# Altium schematic sheet Modems.SchDoc
size A2
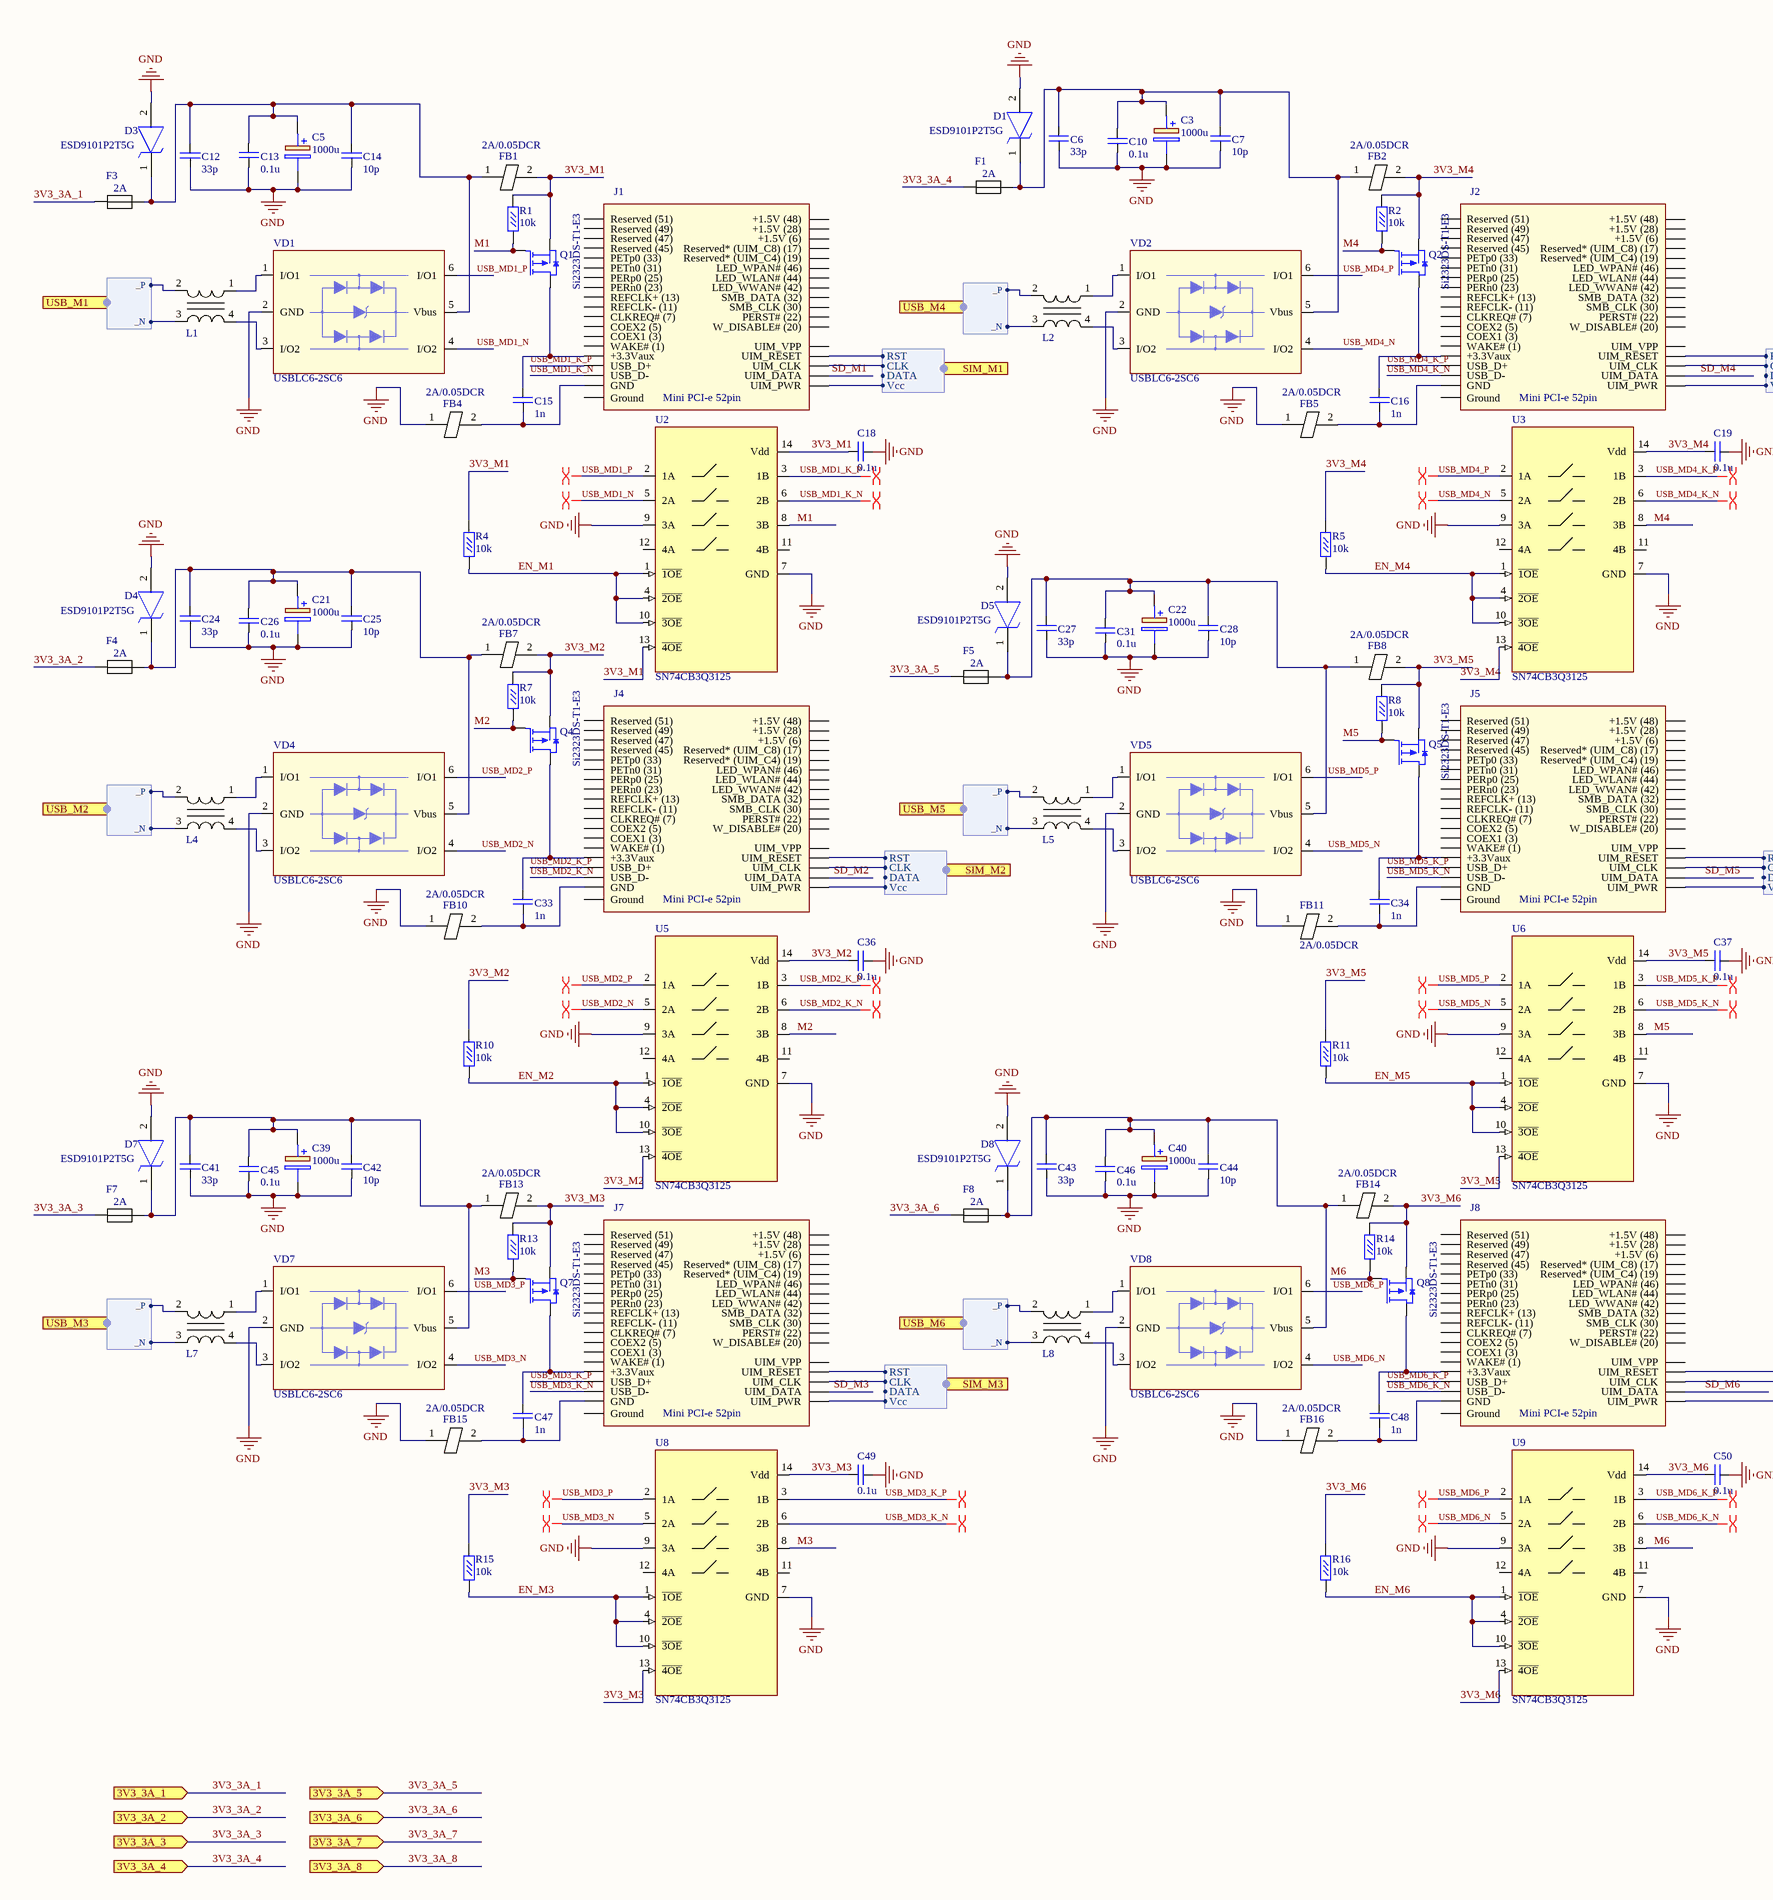
[diagram p0: Modems.SchDoc, left]
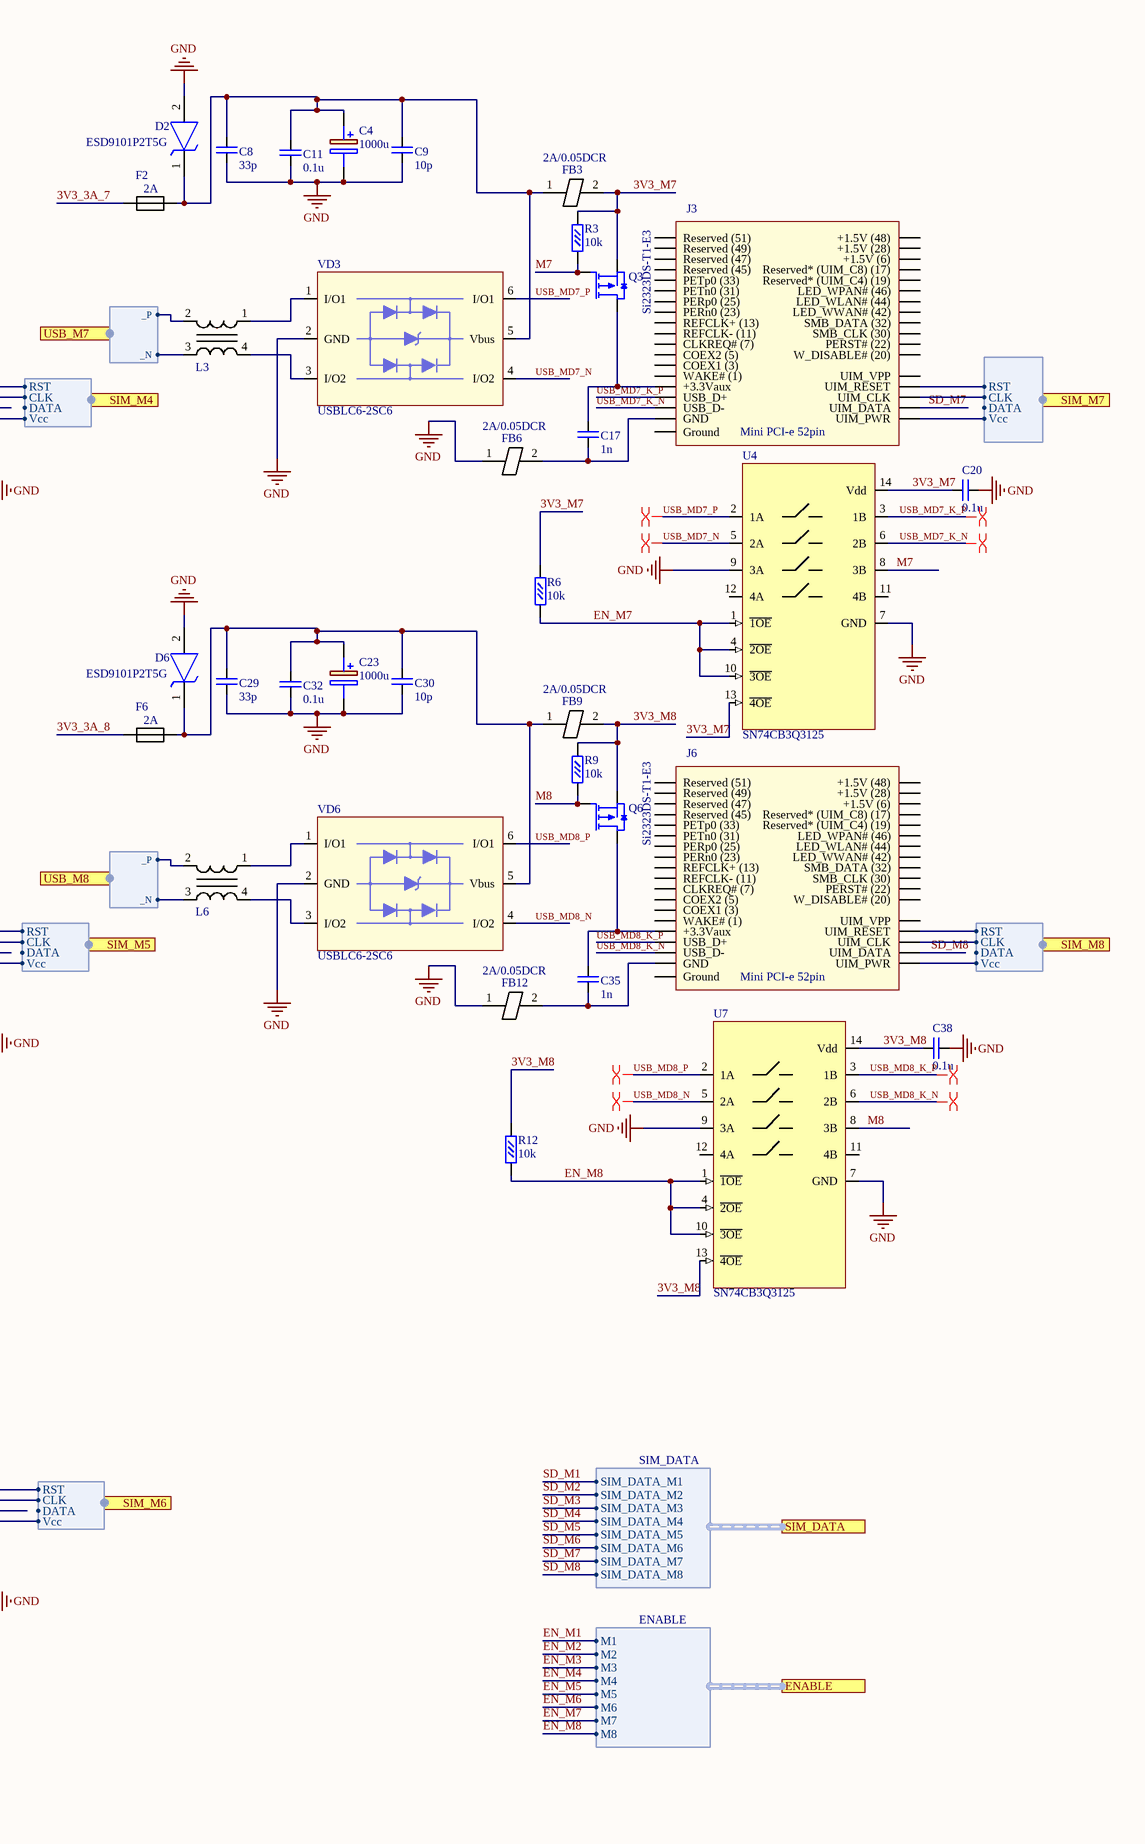
[diagram p1: Modems.SchDoc, right]

## Parts
C3  value 1000u  [CAPAE1030X1030N]  (hidden comment: Конденсатор электролитический алюминиевый, 1000мкФ, 6В, 1010)
C4  value 1000u  [CAPAE1030X1030N]  (hidden comment: Конденсатор электролитический алюминиевый, 1000мкФ, 6В, 1010)
C5  value 1000u  [CAPAE1030X1030N]  (hidden comment: Конденсатор электролитический алюминиевый, 1000мкФ, 6В, 1010)
C6  value 33p  [C0402]  (hidden comment: Конденсатор SMD, 33пФ, X7R, 16В, 10%, 0402)
C7  value 10p  [C0402]  (hidden comment: Конденсатор SMD, 10пФ, X7R, 16В, 10%, 0402)
C8  value 33p  [C0402]  (hidden comment: Конденсатор SMD, 33пФ, X7R, 16В, 10%, 0402)
C9  value 10p  [C0402]  (hidden comment: Конденсатор SMD, 10пФ, X7R, 16В, 10%, 0402)
C10  value 0.1u  [C0402]  (hidden comment: Конденсатор SMD, 0.1мкФ, X7R, 25В, 10%, 0402)
C11  value 0.1u  [C0402]  (hidden comment: Конденсатор SMD, 0.1мкФ, X7R, 25В, 10%, 0402)
C12  value 33p  [C0402]  (hidden comment: Конденсатор SMD, 33пФ, X7R, 16В, 10%, 0402)
C13  value 0.1u  [C0402]  (hidden comment: Конденсатор SMD, 0.1мкФ, X7R, 25В, 10%, 0402)
C14  value 10p  [C0402]  (hidden comment: Конденсатор SMD, 10пФ, X7R, 16В, 10%, 0402)
C15  value 1n  [C0402]  (hidden comment: Конденсатор SMD, 1нФ, X7R, 25В, 10%, 0402)
C16  value 1n  [C0402]  (hidden comment: Конденсатор SMD, 1нФ, X7R, 25В, 10%, 0402)
C17  value 1n  [C0402]  (hidden comment: Конденсатор SMD, 1нФ, X7R, 25В, 10%, 0402)
C18  value 0.1u  [C0402]  (hidden comment: Конденсатор SMD, 0.1мкФ, X7R, 25В, 10%, 0402)
C19  value 0.1u  [C0402]  (hidden comment: Конденсатор SMD, 0.1мкФ, X7R, 25В, 10%, 0402)
C20  value 0.1u  [C0402]  (hidden comment: Конденсатор SMD, 0.1мкФ, X7R, 25В, 10%, 0402)
C21  value 1000u  [CAPAE1030X1030N]  (hidden comment: Конденсатор электролитический алюминиевый, 1000мкФ, 6В, 1010)
C22  value 1000u  [CAPAE1030X1030N]  (hidden comment: Конденсатор электролитический алюминиевый, 1000мкФ, 6В, 1010)
C23  value 1000u  [CAPAE1030X1030N]  (hidden comment: Конденсатор электролитический алюминиевый, 1000мкФ, 6В, 1010)
C24  value 33p  [C0402]  (hidden comment: Конденсатор SMD, 33пФ, X7R, 16В, 10%, 0402)
C25  value 10p  [C0402]  (hidden comment: Конденсатор SMD, 10пФ, X7R, 16В, 10%, 0402)
C26  value 0.1u  [C0402]  (hidden comment: Конденсатор SMD, 0.1мкФ, X7R, 25В, 10%, 0402)
C27  value 33p  [C0402]  (hidden comment: Конденсатор SMD, 33пФ, X7R, 16В, 10%, 0402)
C28  value 10p  [C0402]  (hidden comment: Конденсатор SMD, 10пФ, X7R, 16В, 10%, 0402)
C29  value 33p  [C0402]  (hidden comment: Конденсатор SMD, 33пФ, X7R, 16В, 10%, 0402)
C30  value 10p  [C0402]  (hidden comment: Конденсатор SMD, 10пФ, X7R, 16В, 10%, 0402)
C31  value 0.1u  [C0402]  (hidden comment: Конденсатор SMD, 0.1мкФ, X7R, 25В, 10%, 0402)
C32  value 0.1u  [C0402]  (hidden comment: Конденсатор SMD, 0.1мкФ, X7R, 25В, 10%, 0402)
C33  value 1n  [C0402]  (hidden comment: Конденсатор SMD, 1нФ, X7R, 25В, 10%, 0402)
C34  value 1n  [C0402]  (hidden comment: Конденсатор SMD, 1нФ, X7R, 25В, 10%, 0402)
C35  value 1n  [C0402]  (hidden comment: Конденсатор SMD, 1нФ, X7R, 25В, 10%, 0402)
C36  value 0.1u  [C0402]  (hidden comment: Конденсатор SMD, 0.1мкФ, X7R, 25В, 10%, 0402)
C37  value 0.1u  [C0402]  (hidden comment: Конденсатор SMD, 0.1мкФ, X7R, 25В, 10%, 0402)
C38  value 0.1u  [C0402]  (hidden comment: Конденсатор SMD, 0.1мкФ, X7R, 25В, 10%, 0402)
C39  value 1000u  [CAPAE1030X1030N]  (hidden comment: Конденсатор электролитический алюминиевый, 1000мкФ, 6В, 1010)
C40  value 1000u  [CAPAE1030X1030N]  (hidden comment: Конденсатор электролитический алюминиевый, 1000мкФ, 6В, 1010)
C41  value 33p  [C0402]  (hidden comment: Конденсатор SMD, 33пФ, X7R, 16В, 10%, 0402)
C42  value 10p  [C0402]  (hidden comment: Конденсатор SMD, 10пФ, X7R, 16В, 10%, 0402)
C43  value 33p  [C0402]  (hidden comment: Конденсатор SMD, 33пФ, X7R, 16В, 10%, 0402)
C44  value 10p  [C0402]  (hidden comment: Конденсатор SMD, 10пФ, X7R, 16В, 10%, 0402)
C45  value 0.1u  [C0402]  (hidden comment: Конденсатор SMD, 0.1мкФ, X7R, 25В, 10%, 0402)
C46  value 0.1u  [C0402]  (hidden comment: Конденсатор SMD, 0.1мкФ, X7R, 25В, 10%, 0402)
C47  value 1n  [C0402]  (hidden comment: Конденсатор SMD, 1нФ, X7R, 25В, 10%, 0402)
C48  value 1n  [C0402]  (hidden comment: Конденсатор SMD, 1нФ, X7R, 25В, 10%, 0402)
C49  value 0.1u  [C0402]  (hidden comment: Конденсатор SMD, 0.1мкФ, X7R, 25В, 10%, 0402)
C50  value 0.1u  [C0402]  (hidden comment: Конденсатор SMD, 0.1мкФ, X7R, 25В, 10%, 0402)
D1  ESD9101P2T5G  [SODFL1006X40N]
D2  ESD9101P2T5G  [SODFL1006X40N]
D3  ESD9101P2T5G  [SODFL1006X40N]
D4  ESD9101P2T5G  [SODFL1006X40N]
D5  ESD9101P2T5G  [SODFL1006X40N]
D6  ESD9101P2T5G  [SODFL1006X40N]
D7  ESD9101P2T5G  [SODFL1006X40N]
D8  ESD9101P2T5G  [SODFL1006X40N]
F1  Fuse MF-MSMF 2A  [MF-MSMF Fuse]  (value not drawn)
F2  Fuse MF-MSMF 2A  [MF-MSMF Fuse]  (value not drawn)
F3  Fuse MF-MSMF 2A  [MF-MSMF Fuse]  (value not drawn)
F4  Fuse MF-MSMF 2A  [MF-MSMF Fuse]  (value not drawn)
F5  Fuse MF-MSMF 2A  [MF-MSMF Fuse]  (value not drawn)
F6  Fuse MF-MSMF 2A  [MF-MSMF Fuse]  (value not drawn)
F7  Fuse MF-MSMF 2A  [MF-MSMF Fuse]  (value not drawn)
F8  Fuse MF-MSMF 2A  [MF-MSMF Fuse]  (value not drawn)
FB1  2A/0.05DCR  [RESC2012X70N]
FB2  2A/0.05DCR  [RESC2012X70N]
FB3  2A/0.05DCR  [RESC2012X70N]
FB4  2A/0.05DCR  [RESC2012X70N]
FB5  2A/0.05DCR  [RESC2012X70N]
FB6  2A/0.05DCR  [RESC2012X70N]
FB7  2A/0.05DCR  [RESC2012X70N]
FB8  2A/0.05DCR  [RESC2012X70N]
FB9  2A/0.05DCR  [RESC2012X70N]
FB10  2A/0.05DCR  [RESC2012X70N]
FB11  2A/0.05DCR  [RESC2012X70N]
FB12  2A/0.05DCR  [RESC2012X70N]
FB13  2A/0.05DCR  [RESC2012X70N]
FB14  2A/0.05DCR  [RESC2012X70N]
FB15  2A/0.05DCR  [RESC2012X70N]
FB16  2A/0.05DCR  [RESC2012X70N]
J1  Mini PCI-e 52pin  [Mini PCI-E 52pin 2 mnt]
J2  Mini PCI-e 52pin  [Mini PCI-E 52pin 2 mnt]
J3  Mini PCI-e 52pin  [Mini PCI-E 52pin 2 mnt]
J4  Mini PCI-e 52pin  [Mini PCI-E 52pin 2 mnt]
J5  Mini PCI-e 52pin  [Mini PCI-E 52pin 2 mnt]
J6  Mini PCI-e 52pin  [Mini PCI-E 52pin 2 mnt]
J7  Mini PCI-e 52pin  [Mini PCI-E 52pin 2 mnt]
J8  Mini PCI-e 52pin  [Mini PCI-E 52pin 2 mnt]
L1  Inductor ESD (Choke)  [EMI Choke Murata]  (value not drawn)
L2  Inductor ESD (Choke)  [EMI Choke Murata]  (value not drawn)
L3  Inductor ESD (Choke)  [EMI Choke Murata]  (value not drawn)
L4  Inductor ESD (Choke)  [EMI Choke Murata]  (value not drawn)
L5  Inductor ESD (Choke)  [EMI Choke Murata]  (value not drawn)
L6  Inductor ESD (Choke)  [EMI Choke Murata]  (value not drawn)
L7  Inductor ESD (Choke)  [EMI Choke Murata]  (value not drawn)
L8  Inductor ESD (Choke)  [EMI Choke Murata]  (value not drawn)
Q1  Транзистор, Si2323DS-T1-E3  [SOT23]  (value not drawn)
Q2  Транзистор, Si2323DS-T1-E3  [SOT23]  (value not drawn)
Q3  Транзистор, Si2323DS-T1-E3  [SOT23]  (value not drawn)
Q4  Транзистор, Si2323DS-T1-E3  [SOT23]  (value not drawn)
Q5  Транзистор, Si2323DS-T1-E3  [SOT23]  (value not drawn)
Q6  Транзистор, Si2323DS-T1-E3  [SOT23]  (value not drawn)
Q7  Транзистор, Si2323DS-T1-E3  [SOT23]  (value not drawn)
Q8  Транзистор, Si2323DS-T1-E3  [SOT23]  (value not drawn)
R1  value 10k  [R0603]  (hidden comment: Резистор SMD, 0.1Вт, 0603, 10кОм, 1%)
R2  value 10k  [R0603]  (hidden comment: Резистор SMD, 0.1Вт, 0603, 10кОм, 1%)
R3  value 10k  [R0603]  (hidden comment: Резистор SMD, 0.1Вт, 0603, 10кОм, 1%)
R4  value 10k  [R0603]  (hidden comment: Резистор SMD, 0.1Вт, 0603, 10кОм, 1%)
R5  value 10k  [R0603]  (hidden comment: Резистор SMD, 0.1Вт, 0603, 10кОм, 1%)
R6  value 10k  [R0603]  (hidden comment: Резистор SMD, 0.1Вт, 0603, 10кОм, 1%)
R7  value 10k  [R0603]  (hidden comment: Резистор SMD, 0.1Вт, 0603, 10кОм, 1%)
R8  value 10k  [R0603]  (hidden comment: Резистор SMD, 0.1Вт, 0603, 10кОм, 1%)
R9  value 10k  [R0603]  (hidden comment: Резистор SMD, 0.1Вт, 0603, 10кОм, 1%)
R10  value 10k  [R0603]  (hidden comment: Резистор SMD, 0.1Вт, 0603, 10кОм, 1%)
R11  value 10k  [R0603]  (hidden comment: Резистор SMD, 0.1Вт, 0603, 10кОм, 1%)
R12  value 10k  [R0603]  (hidden comment: Резистор SMD, 0.1Вт, 0603, 10кОм, 1%)
R13  value 10k  [R0603]  (hidden comment: Резистор SMD, 0.1Вт, 0603, 10кОм, 1%)
R14  value 10k  [R0603]  (hidden comment: Резистор SMD, 0.1Вт, 0603, 10кОм, 1%)
R15  value 10k  [R0603]  (hidden comment: Резистор SMD, 0.1Вт, 0603, 10кОм, 1%)
R16  value 10k  [R0603]  (hidden comment: Резистор SMD, 0.1Вт, 0603, 10кОм, 1%)
U2  Микросхема, SN74CB3Q3125  [14-TSOP]  (value not drawn)
U3  Микросхема, SN74CB3Q3125  [14-TSOP]  (value not drawn)
U4  Микросхема, SN74CB3Q3125  [14-TSOP]  (value not drawn)
U5  Микросхема, SN74CB3Q3125  [14-TSOP]  (value not drawn)
U6  Микросхема, SN74CB3Q3125  [14-TSOP]  (value not drawn)
U7  Микросхема, SN74CB3Q3125  [14-TSOP]  (value not drawn)
U8  Микросхема, SN74CB3Q3125  [14-TSOP]  (value not drawn)
U9  Микросхема, SN74CB3Q3125  [14-TSOP]  (value not drawn)
VD1  TVS Diode  [SOT23-6L]  (value not drawn)
VD2  TVS Diode  [SOT23-6L]  (value not drawn)
VD3  TVS Diode  [SOT23-6L]  (value not drawn)
VD4  TVS Diode  [SOT23-6L]  (value not drawn)
VD5  TVS Diode  [SOT23-6L]  (value not drawn)
VD6  TVS Diode  [SOT23-6L]  (value not drawn)
VD7  TVS Diode  [SOT23-6L]  (value not drawn)
VD8  TVS Diode  [SOT23-6L]  (value not drawn)

## Ports
3V3_3A_1 (in), 3V3_3A_2 (in), 3V3_3A_3 (in), 3V3_3A_4 (in), 3V3_3A_5 (in), 3V3_3A_6 (in), 3V3_3A_7 (in), 3V3_3A_8 (in), ENABLE (harness ENABLE), SIM_DATA (harness SIM_DATA), SIM_M1 (harness SIM), SIM_M2 (harness SIM), SIM_M3 (harness SIM), SIM_M4 (harness SIM), SIM_M5 (harness SIM), SIM_M6 (harness SIM), SIM_M7 (harness SIM), SIM_M8 (harness SIM), USB_M1 (harness DIFF), USB_M2 (harness DIFF), USB_M3 (harness DIFF), USB_M4 (harness DIFF), USB_M5 (harness DIFF), USB_M6 (harness DIFF), USB_M7 (harness DIFF), USB_M8 (harness DIFF)

## Harnesses
SIM: Vcc, RST, CLK, DATA
DIFF: _P, _N
SIM_DATA: SIM_DATA_M1, SIM_DATA_M2, SIM_DATA_M3, SIM_DATA_M4, SIM_DATA_M5, SIM_DATA_M6, SIM_DATA_M7, SIM_DATA_M8
ENABLE: M1, M2, M3, M4, M5, M6, M7, M8

## Nets
GND: C3.2(-) C4.2(-) C5.2(-) C6.1 C7.1 C8.1 C9.1 C10.2 C11.2 C12.1 C13.2 C14.1 C18.2 C19.2 C20.2 C21.2(-) C22.2(-) C23.2(-) C24.1 C25.1 C26.2 C27.1 C28.1 C29.1 C30.1 C31.2 C32.2 C36.2 C37.2 C38.2 C39.2(-) C40.2(-) C41.1 C42.1 C43.1 C44.1 C45.2 C46.2 C49.2 C50.2 D1.2(A) D2.2(A) D3.2(A) D4.2(A) D5.2(A) D6.2(A) D7.2(A) D8.2(A) FB4.1 FB5.1 FB6.1 FB10.1 FB11.1 FB12.1 FB15.1 FB16.1 U2.7(GND) U2.9(3A) U3.7(GND) U3.9(3A) U4.7(GND) U4.9(3A) U5.7(GND) U5.9(3A) U6.7(GND) U6.9(3A) U7.7(GND) U7.9(3A) U8.7(GND) U8.9(3A) U9.7(GND) U9.9(3A) VD1.2(GND) VD2.2(GND) VD3.2(GND) VD4.2(GND) VD5.2(GND) VD6.2(GND) VD7.2(GND) VD8.2(GND)
3V3_3A_1: F3.1 ; port 3V3_3A_1
3V3_3A_2: F4.1 ; port 3V3_3A_2
3V3_3A_3: F7.1 ; port 3V3_3A_3
3V3_3A_4: F1.1 ; port 3V3_3A_4
3V3_3A_5: F5.1 ; port 3V3_3A_5
3V3_3A_6: F8.1 ; port 3V3_3A_6
3V3_3A_7: F2.1 ; port 3V3_3A_7
3V3_3A_8: F6.1 ; port 3V3_3A_8
3V3_M1: C18.1 FB1.2 Q1.2(S) R1.2 R4.2 U2.13(~{4OE}) U2.14(Vdd)
3V3_M2: C36.1 FB7.2 Q4.2(S) R7.2 R10.2 U5.13(~{4OE}) U5.14(Vdd)
3V3_M3: C49.1 FB13.2 Q7.2(S) R13.2 R15.2 U8.13(~{4OE}) U8.14(Vdd)
3V3_M4: C19.1 FB2.2 Q2.2(S) R2.2 R5.2 U3.13(~{4OE}) U3.14(Vdd)
3V3_M5: C37.1 FB8.2 Q5.2(S) R8.2 R11.2 U6.13(~{4OE}) U6.14(Vdd)
3V3_M6: C50.1 FB14.2 Q8.2(S) R14.2 R16.2 U9.13(~{4OE}) U9.14(Vdd)
3V3_M7: C20.1 FB3.2 Q3.2(S) R3.2 R6.2 U4.13(~{4OE}) U4.14(Vdd)
3V3_M8: C38.1 FB9.2 Q6.2(S) R9.2 R12.2 U7.13(~{4OE}) U7.14(Vdd)
EN_M1: R4.1 U2.1(~{1OE}) U2.4(~{2OE}) U2.10(~{3OE}) ; port ENABLE.M1
EN_M2: R10.1 U5.1(~{1OE}) U5.4(~{2OE}) U5.10(~{3OE}) ; port ENABLE.M2
EN_M3: R15.1 U8.1(~{1OE}) U8.4(~{2OE}) U8.10(~{3OE}) ; port ENABLE.M3
EN_M4: R5.1 U3.1(~{1OE}) U3.4(~{2OE}) U3.10(~{3OE}) ; port ENABLE.M4
EN_M5: R11.1 U6.1(~{1OE}) U6.4(~{2OE}) U6.10(~{3OE}) ; port ENABLE.M5
EN_M6: R16.1 U9.1(~{1OE}) U9.4(~{2OE}) U9.10(~{3OE}) ; port ENABLE.M6
EN_M7: R6.1 U4.1(~{1OE}) U4.4(~{2OE}) U4.10(~{3OE}) ; port ENABLE.M7
EN_M8: R12.1 U7.1(~{1OE}) U7.4(~{2OE}) U7.10(~{3OE}) ; port ENABLE.M8
M1: Q1.1(G) R1.1 U2.8(3B)
M2: Q4.1(G) R7.1 U5.8(3B)
M3: Q7.1(G) R13.1 U8.8(3B)
M4: Q2.1(G) R2.1 U3.8(3B)
M5: Q5.1(G) R8.1 U6.8(3B)
M6: Q8.1(G) R14.1 U9.8(3B)
M7: Q3.1(G) R3.1 U4.8(3B)
M8: Q6.1(G) R9.1 U7.8(3B)
SD_M1: J1.10(UIM_DATA) ; port SIM_DATA.SIM_DATA_M1
SD_M2: J4.10(UIM_DATA) ; port SIM_DATA.SIM_DATA_M2
SD_M3: J7.10(UIM_DATA) ; port SIM_DATA.SIM_DATA_M3
SD_M4: J2.10(UIM_DATA) ; port SIM_DATA.SIM_DATA_M4
SD_M5: J5.10(UIM_DATA) ; port SIM_DATA.SIM_DATA_M5
SD_M6: J8.10(UIM_DATA) ; port SIM_DATA.SIM_DATA_M6
SD_M7: J3.10(UIM_DATA) ; port SIM_DATA.SIM_DATA_M7
SD_M8: J6.10(UIM_DATA) ; port SIM_DATA.SIM_DATA_M8
USB_MD1_K_N: J1.36(USB_D-) U2.6(2B)
USB_MD1_K_P: J1.38(USB_D+) U2.3(1B)
USB_MD1_N: U2.5(2A) VD1.4(I/O2)
USB_MD1_P: U2.2(1A) VD1.6(I/O1)
USB_MD2_K_N: J4.36(USB_D-) U5.6(2B)
USB_MD2_K_P: J4.38(USB_D+) U5.3(1B)
USB_MD2_N: U5.5(2A) VD4.4(I/O2)
USB_MD2_P: U5.2(1A) VD4.6(I/O1)
USB_MD3_K_N: J7.36(USB_D-) U8.6(2B)
USB_MD3_K_P: J7.38(USB_D+) U8.3(1B)
USB_MD3_N: U8.5(2A) VD7.4(I/O2)
USB_MD3_P: U8.2(1A) VD7.6(I/O1)
USB_MD4_K_N: J2.36(USB_D-) U3.6(2B)
USB_MD4_K_P: J2.38(USB_D+) U3.3(1B)
USB_MD4_N: U3.5(2A) VD2.4(I/O2)
USB_MD4_P: U3.2(1A) VD2.6(I/O1)
USB_MD5_K_N: J5.36(USB_D-) U6.6(2B)
USB_MD5_K_P: J5.38(USB_D+) U6.3(1B)
USB_MD5_N: U6.5(2A) VD5.4(I/O2)
USB_MD5_P: U6.2(1A) VD5.6(I/O1)
USB_MD6_K_N: J8.36(USB_D-) U9.6(2B)
USB_MD6_K_P: J8.38(USB_D+) U9.3(1B)
USB_MD6_N: U9.5(2A) VD8.4(I/O2)
USB_MD6_P: U9.2(1A) VD8.6(I/O1)
USB_MD7_K_N: J3.36(USB_D-) U4.6(2B)
USB_MD7_K_P: J3.38(USB_D+) U4.3(1B)
USB_MD7_N: U4.5(2A) VD3.4(I/O2)
USB_MD7_P: U4.2(1A) VD3.6(I/O1)
USB_MD8_K_N: J6.36(USB_D-) U7.6(2B)
USB_MD8_K_P: J6.38(USB_D+) U7.3(1B)
USB_MD8_N: U7.5(2A) VD6.4(I/O2)
USB_MD8_P: U7.2(1A) VD6.6(I/O1)
NetC3_1: C3.1(+) C6.2 C7.2 C10.1 D1.1(K) F1.2 FB2.1 VD2.5(Vbus)
NetC4_1: C4.1(+) C8.2 C9.2 C11.1 D2.1(K) F2.2 FB3.1 VD3.5(Vbus)
NetC5_1: C5.1(+) C12.2 C13.1 C14.2 D3.1(K) F3.2 FB1.1 VD1.5(Vbus)
NetC15_1: C15.1 J1.3v3(+3.3Vaux) Q1.3(D)
NetC15_2: C15.2 FB4.2 J1.GND
NetC16_1: C16.1 J2.3v3(+3.3Vaux) Q2.3(D)
NetC16_2: C16.2 FB5.2 J2.GND
NetC17_1: C17.1 J3.3v3(+3.3Vaux) Q3.3(D)
NetC17_2: C17.2 FB6.2 J3.GND
NetC21_1: C21.1(+) C24.2 C25.2 C26.1 D4.1(K) F4.2 FB7.1 VD4.5(Vbus)
NetC22_1: C22.1(+) C27.2 C28.2 C31.1 D5.1(K) F5.2 FB8.1 VD5.5(Vbus)
NetC23_1: C23.1(+) C29.2 C30.2 C32.1 D6.1(K) F6.2 FB9.1 VD6.5(Vbus)
NetC33_1: C33.1 J4.3v3(+3.3Vaux) Q4.3(D)
NetC33_2: C33.2 FB10.2 J4.GND
NetC34_1: C34.1 J5.3v3(+3.3Vaux) Q5.3(D)
NetC34_2: C34.2 FB11.2 J5.GND
NetC35_1: C35.1 J6.3v3(+3.3Vaux) Q6.3(D)
NetC35_2: C35.2 FB12.2 J6.GND
NetC39_1: C39.1(+) C41.2 C42.2 C45.1 D7.1(K) F7.2 FB13.1 VD7.5(Vbus)
NetC40_1: C40.1(+) C43.2 C44.2 C46.1 D8.1(K) F8.2 FB14.1 VD8.5(Vbus)
NetC47_1: C47.1 J7.3v3(+3.3Vaux) Q7.3(D)
NetC47_2: C47.2 FB15.2 J7.GND
NetC48_1: C48.1 J8.3v3(+3.3Vaux) Q8.3(D)
NetC48_2: C48.2 FB16.2 J8.GND
NetJ1_8: J1.8(UIM_PWR) ; port SIM_M1.Vcc
NetJ1_12: J1.12(UIM_CLK) ; port SIM_M1.CLK
NetJ1_14: J1.14(UIM_RESET) ; port SIM_M1.RST
NetJ2_8: J2.8(UIM_PWR) ; port SIM_M4.Vcc
NetJ2_12: J2.12(UIM_CLK) ; port SIM_M4.CLK
NetJ2_14: J2.14(UIM_RESET) ; port SIM_M4.RST
NetJ3_8: J3.8(UIM_PWR) ; port SIM_M7.Vcc
NetJ3_12: J3.12(UIM_CLK) ; port SIM_M7.CLK
NetJ3_14: J3.14(UIM_RESET) ; port SIM_M7.RST
NetJ4_8: J4.8(UIM_PWR) ; port SIM_M2.Vcc
NetJ4_12: J4.12(UIM_CLK) ; port SIM_M2.CLK
NetJ4_14: J4.14(UIM_RESET) ; port SIM_M2.RST
NetJ5_8: J5.8(UIM_PWR) ; port SIM_M5.Vcc
NetJ5_12: J5.12(UIM_CLK) ; port SIM_M5.CLK
NetJ5_14: J5.14(UIM_RESET) ; port SIM_M5.RST
NetJ6_8: J6.8(UIM_PWR) ; port SIM_M8.Vcc
NetJ6_12: J6.12(UIM_CLK) ; port SIM_M8.CLK
NetJ6_14: J6.14(UIM_RESET) ; port SIM_M8.RST
NetJ7_8: J7.8(UIM_PWR) ; port SIM_M3.Vcc
NetJ7_12: J7.12(UIM_CLK) ; port SIM_M3.CLK
NetJ7_14: J7.14(UIM_RESET) ; port SIM_M3.RST
NetJ8_8: J8.8(UIM_PWR) ; port SIM_M6.Vcc
NetJ8_12: J8.12(UIM_CLK) ; port SIM_M6.CLK
NetJ8_14: J8.14(UIM_RESET) ; port SIM_M6.RST
NetL1_1: L1.1 VD1.1(I/O1)
NetL1_2: L1.2 ; port USB_M1._P
NetL1_3: L1.3 ; port USB_M1._N
NetL1_4: L1.4 VD1.3(I/O2)
NetL2_1: L2.1 VD2.1(I/O1)
NetL2_2: L2.2 ; port USB_M4._P
NetL2_3: L2.3 ; port USB_M4._N
NetL2_4: L2.4 VD2.3(I/O2)
NetL3_1: L3.1 VD3.1(I/O1)
NetL3_2: L3.2 ; port USB_M7._P
NetL3_3: L3.3 ; port USB_M7._N
NetL3_4: L3.4 VD3.3(I/O2)
NetL4_1: L4.1 VD4.1(I/O1)
NetL4_2: L4.2 ; port USB_M2._P
NetL4_3: L4.3 ; port USB_M2._N
NetL4_4: L4.4 VD4.3(I/O2)
NetL5_1: L5.1 VD5.1(I/O1)
NetL5_2: L5.2 ; port USB_M5._P
NetL5_3: L5.3 ; port USB_M5._N
NetL5_4: L5.4 VD5.3(I/O2)
NetL6_1: L6.1 VD6.1(I/O1)
NetL6_2: L6.2 ; port USB_M8._P
NetL6_3: L6.3 ; port USB_M8._N
NetL6_4: L6.4 VD6.3(I/O2)
NetL7_1: L7.1 VD7.1(I/O1)
NetL7_2: L7.2 ; port USB_M3._P
NetL7_3: L7.3 ; port USB_M3._N
NetL7_4: L7.4 VD7.3(I/O2)
NetL8_1: L8.1 VD8.1(I/O1)
NetL8_2: L8.2 ; port USB_M6._P
NetL8_3: L8.3 ; port USB_M6._N
NetL8_4: L8.4 VD8.3(I/O2)

Not connected (* = marked no-connect by the designer): J1 0(Ground) 1(WAKE#_(1)) 3(COEX1_(3)) 5(COEX2_(5)) 6(+1.5V_(6)) 7(CLKREQ#_(7)) 11(REFCLK-_(11)) 13(REFCLK+_(13)) 16(UIM_VPP) 17(Reserved*_(UIM_C8)_(17)) 19(Reserved*_(UIM_C4)_(19)) 20(W_DISABLE#_(20)) 22(PERST#_(22)) 23(PERn0_(23)) 25(PERp0_(25)) 28(+1.5V_(28)) 30(SMB_CLK_(30)) 31(PETn0_(31)) 32(SMB_DATA_(32)) 33(PETp0_(33)) 42(LED_WWAN#_(42)) 44(LED_WLAN#_(44)) 45(Reserved_(45)) 46(LED_WPAN#_(46)) 47(Reserved_(47)) 48(+1.5V_(48)) 49(Reserved_(49)) 51(Reserved_(51)); J2 0(Ground) 1(WAKE#_(1)) 3(COEX1_(3)) 5(COEX2_(5)) 6(+1.5V_(6)) 7(CLKREQ#_(7)) 11(REFCLK-_(11)) 13(REFCLK+_(13)) 16(UIM_VPP) 17(Reserved*_(UIM_C8)_(17)) 19(Reserved*_(UIM_C4)_(19)) 20(W_DISABLE#_(20)) 22(PERST#_(22)) 23(PERn0_(23)) 25(PERp0_(25)) 28(+1.5V_(28)) 30(SMB_CLK_(30)) 31(PETn0_(31)) 32(SMB_DATA_(32)) 33(PETp0_(33)) 42(LED_WWAN#_(42)) 44(LED_WLAN#_(44)) 45(Reserved_(45)) 46(LED_WPAN#_(46)) 47(Reserved_(47)) 48(+1.5V_(48)) 49(Reserved_(49)) 51(Reserved_(51)); J3 0(Ground) 1(WAKE#_(1)) 3(COEX1_(3)) 5(COEX2_(5)) 6(+1.5V_(6)) 7(CLKREQ#_(7)) 11(REFCLK-_(11)) 13(REFCLK+_(13)) 16(UIM_VPP) 17(Reserved*_(UIM_C8)_(17)) 19(Reserved*_(UIM_C4)_(19)) 20(W_DISABLE#_(20)) 22(PERST#_(22)) 23(PERn0_(23)) 25(PERp0_(25)) 28(+1.5V_(28)) 30(SMB_CLK_(30)) 31(PETn0_(31)) 32(SMB_DATA_(32)) 33(PETp0_(33)) 42(LED_WWAN#_(42)) 44(LED_WLAN#_(44)) 45(Reserved_(45)) 46(LED_WPAN#_(46)) 47(Reserved_(47)) 48(+1.5V_(48)) 49(Reserved_(49)) 51(Reserved_(51)); J4 0(Ground) 1(WAKE#_(1)) 3(COEX1_(3)) 5(COEX2_(5)) 6(+1.5V_(6)) 7(CLKREQ#_(7)) 11(REFCLK-_(11)) 13(REFCLK+_(13)) 16(UIM_VPP) 17(Reserved*_(UIM_C8)_(17)) 19(Reserved*_(UIM_C4)_(19)) 20(W_DISABLE#_(20)) 22(PERST#_(22)) 23(PERn0_(23)) 25(PERp0_(25)) 28(+1.5V_(28)) 30(SMB_CLK_(30)) 31(PETn0_(31)) 32(SMB_DATA_(32)) 33(PETp0_(33)) 42(LED_WWAN#_(42)) 44(LED_WLAN#_(44)) 45(Reserved_(45)) 46(LED_WPAN#_(46)) 47(Reserved_(47)) 48(+1.5V_(48)) 49(Reserved_(49)) 51(Reserved_(51)); J5 0(Ground) 1(WAKE#_(1)) 3(COEX1_(3)) 5(COEX2_(5)) 6(+1.5V_(6)) 7(CLKREQ#_(7)) 11(REFCLK-_(11)) 13(REFCLK+_(13)) 16(UIM_VPP) 17(Reserved*_(UIM_C8)_(17)) 19(Reserved*_(UIM_C4)_(19)) 20(W_DISABLE#_(20)) 22(PERST#_(22)) 23(PERn0_(23)) 25(PERp0_(25)) 28(+1.5V_(28)) 30(SMB_CLK_(30)) 31(PETn0_(31)) 32(SMB_DATA_(32)) 33(PETp0_(33)) 42(LED_WWAN#_(42)) 44(LED_WLAN#_(44)) 45(Reserved_(45)) 46(LED_WPAN#_(46)) 47(Reserved_(47)) 48(+1.5V_(48)) 49(Reserved_(49)) 51(Reserved_(51)); J6 0(Ground) 1(WAKE#_(1)) 3(COEX1_(3)) 5(COEX2_(5)) 6(+1.5V_(6)) 7(CLKREQ#_(7)) 11(REFCLK-_(11)) 13(REFCLK+_(13)) 16(UIM_VPP) 17(Reserved*_(UIM_C8)_(17)) 19(Reserved*_(UIM_C4)_(19)) 20(W_DISABLE#_(20)) 22(PERST#_(22)) 23(PERn0_(23)) 25(PERp0_(25)) 28(+1.5V_(28)) 30(SMB_CLK_(30)) 31(PETn0_(31)) 32(SMB_DATA_(32)) 33(PETp0_(33)) 42(LED_WWAN#_(42)) 44(LED_WLAN#_(44)) 45(Reserved_(45)) 46(LED_WPAN#_(46)) 47(Reserved_(47)) 48(+1.5V_(48)) 49(Reserved_(49)) 51(Reserved_(51)); J7 0(Ground) 1(WAKE#_(1)) 3(COEX1_(3)) 5(COEX2_(5)) 6(+1.5V_(6)) 7(CLKREQ#_(7)) 11(REFCLK-_(11)) 13(REFCLK+_(13)) 16(UIM_VPP) 17(Reserved*_(UIM_C8)_(17)) 19(Reserved*_(UIM_C4)_(19)) 20(W_DISABLE#_(20)) 22(PERST#_(22)) 23(PERn0_(23)) 25(PERp0_(25)) 28(+1.5V_(28)) 30(SMB_CLK_(30)) 31(PETn0_(31)) 32(SMB_DATA_(32)) 33(PETp0_(33)) 42(LED_WWAN#_(42)) 44(LED_WLAN#_(44)) 45(Reserved_(45)) 46(LED_WPAN#_(46)) 47(Reserved_(47)) 48(+1.5V_(48)) 49(Reserved_(49)) 51(Reserved_(51)); J8 0(Ground) 1(WAKE#_(1)) 3(COEX1_(3)) 5(COEX2_(5)) 6(+1.5V_(6)) 7(CLKREQ#_(7)) 11(REFCLK-_(11)) 13(REFCLK+_(13)) 16(UIM_VPP) 17(Reserved*_(UIM_C8)_(17)) 19(Reserved*_(UIM_C4)_(19)) 20(W_DISABLE#_(20)) 22(PERST#_(22)) 23(PERn0_(23)) 25(PERp0_(25)) 28(+1.5V_(28)) 30(SMB_CLK_(30)) 31(PETn0_(31)) 32(SMB_DATA_(32)) 33(PETp0_(33)) 42(LED_WWAN#_(42)) 44(LED_WLAN#_(44)) 45(Reserved_(45)) 46(LED_WPAN#_(46)) 47(Reserved_(47)) 48(+1.5V_(48)) 49(Reserved_(49)) 51(Reserved_(51)); U2 11(4B) 12(4A); U3 11(4B) 12(4A); U4 11(4B) 12(4A); U5 11(4B) 12(4A); U6 11(4B) 12(4A); U7 11(4B) 12(4A); U8 11(4B) 12(4A); U9 11(4B) 12(4A)

## Layout directives
differential pair: USB_MD1_K_N, USB_MD1_K_P, USB_MD1_N, USB_MD1_P, USB_MD2_K_N, USB_MD2_K_P, USB_MD2_N, USB_MD2_P, USB_MD3_K_N, USB_MD3_K_P, USB_MD3_N, USB_MD3_P, USB_MD4_K_N, USB_MD4_K_P, USB_MD4_N, USB_MD4_P, USB_MD5_K_N, USB_MD5_K_P, USB_MD5_N, USB_MD5_P, USB_MD6_K_N, USB_MD6_K_P, USB_MD6_N, USB_MD6_P, USB_MD7_K_N, USB_MD7_K_P, USB_MD7_N, USB_MD7_P, USB_MD8_K_N, USB_MD8_K_P, USB_MD8_N, USB_MD8_P

## Notes on the sheet
- (in symbol Fuse MF-MSMF 2A) 2A

## Library data of the parts
C3-C5 C21-C23 C39 C40 = APXG160ARA102MJA0G: Capacitor Polarised Electrolytic Aluminium, 1010; Manufacturer_Name: United Chemi-Con (UCC); Datasheet Link: https://www.mouser.co.uk/datasheet/2/420/United-Chemi-Con-775864.pdf; Height: 10.3mm; Manufacturer_Part_Number: APXG160ARA102MJA0G; Voltage: 6В; Family: Конденсатор электролитический алюминиевый; Package: 1010; Capacitance: 1000мкФ
C6 C8 C12 C24 C27 C29 C41 C43 = C0402: Chip Capacitor 0402; Assembly: 33p_X7R_16V_10%_0402; Voltage_assembly: 16V; Voltage: 16В; Tolerance: 10%; TemperatureCoeff: X7R; Family: Конденсатор SMD; Capacitance: 33пФ; Package: 0402
C7 C9 C14 C25 C28 C30 C42 C44 = C0402: Chip Capacitor 0402; Assembly: 10p_X7R_16V_10%_0402; Voltage_assembly: 16V; Voltage: 16В; Tolerance: 10%; TemperatureCoeff: X7R; Family: Конденсатор SMD; Capacitance: 10пФ; Package: 0402
C10 C11 C13 C18-C20 C26 C31 C32 C36-C38 C45 C46 C49 C50 = C0402: Chip Capacitor 0402; Assembly: 0.1u_X7R_25V_10%_0402; Voltage_assembly: 25V; Tolerance: 10%; Voltage: 25В; TemperatureCoeff: X7R; Family: Конденсатор SMD; Capacitance: 0.1мкФ; Package: 0402
C15-C17 C33-C35 C47 C48 = C0402: Chip Capacitor 0402; Assembly: 1n_X7R_25V_10%_0402; Voltage_assembly: 25V; Tolerance: 10%; Voltage: 25В; TemperatureCoeff: X7R; Family: Конденсатор SMD; Capacitance: 1нФ; Package: 0402
D1-D8 = ESD9101P2T5G: TVS Diode (Uni-directional); Manufacturer_Name: ON Semiconductor; Datasheet Link: http://www.onsemi.com/pub/Collateral/ESD9101-D.PDF; Height: 0.4mm; Manufacturer_Part_Number: ESD9101P2T5G; Family: Диод защитный; PartNumber: ESD9101P2T5G
FB1-FB16 = Ferrite Bead 2A/0.05DCR
L1-L8 = Inductor ESD (Choke): DLW21HN900SQ2L
Q1-Q8 = Si2323DS-T1-E3: P-Shannel Power MOSFET, 3.7A, 1.25 W; Manufacturer: Vishay; Family: Транзистор; Package: SOT23; Assembly: Si2323DS-T1-E3; PartNumber: Si2323DS-T1-E3
R1-R16 = R0603_0.1: Chip Resistor 0603, 0.1 W; Assembly: 10k_0.1W_1%_0603; Power_assembly: 0.1W; Power: 0.1Вт; Tolerance: 1%; Family: Резистор SMD; Package: 0603; Resistance: 10кОм
U2-U9 = SN74CB3Q3125: Quadruple FET Bus Switch; Manufacturer: Texas Instruments; Family: Микросхема; Package: TSSOP-14; PartNumber: SN74CB3Q3125
VD1-VD8 = USBLC6-2SC6: Very low capacitance ESD protection; Manufacturer: STMicroelectronics; Part Number: USBLC6-2SC6